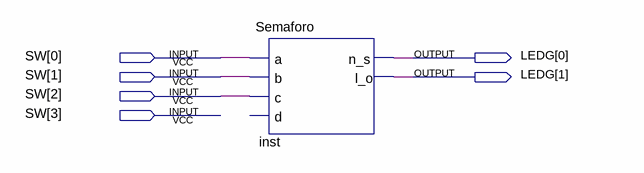
[diagram p0: schematic sheet]
// Quartus schematic SemaforoDiagrama.bdf as structural Verilog: 1 symbols, 6 pins
module SemaforoDiagrama (
  input  [3:0] SW,
  output [1:0] LEDG
);

  Semaforo inst (.a(SW[0]), .b(SW[1]), .c(SW[2]), .n_s(LEDG[0]), .l_o(LEDG[1]));  // open: d
endmodule
